# EAGLE design OBS-buttons-processor (EAGLE 7.7.0)
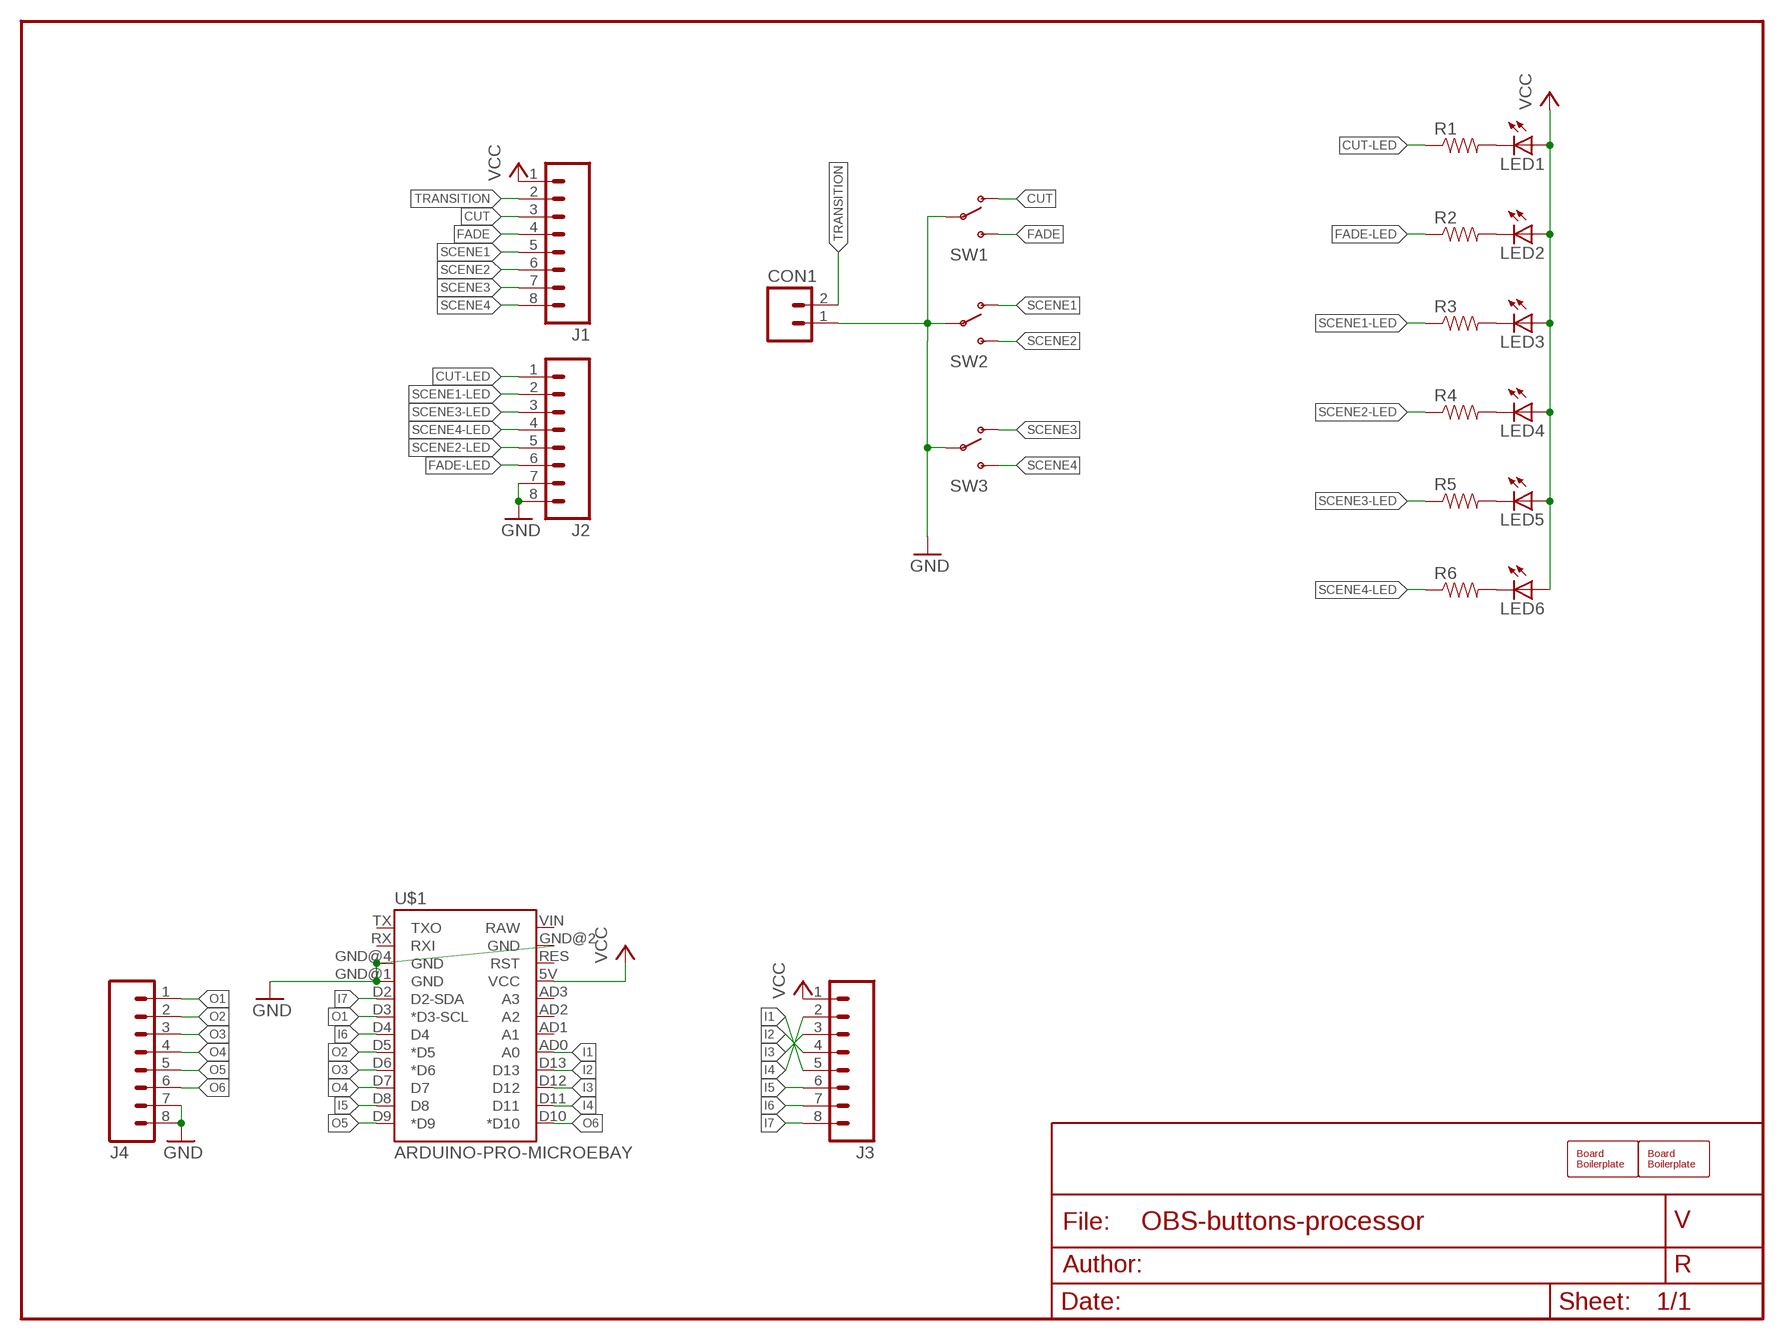
[diagram p0: schematic, sheet 1]

## Parts
BOARD1  BOARD100X50-NOHOLES  [BOARD-SEEED10X5-NOHOLES]
BOARD2  BOARD100X50-NOHOLES  [BOARD-SEEED10X5-NOHOLES]
CON1  CONNECTOR-M02508-LOCK  [MSTB2]
J1  CONNECTOR-M08LOCK  [1X08_LOCK]
J2  CONNECTOR-M08LOCK  [1X08_LOCK]
J3  CONNECTOR-M08LOCK  [1X08_LOCK]
J4  CONNECTOR-M08LOCK  [1X08_LOCK]
LED1  LEDLED5MM  [LED5MM]
LED2  LEDLED5MM  [LED5MM]
LED3  LEDLED5MM  [LED5MM]
LED4  LEDLED5MM  [LED5MM]
LED5  LEDLED5MM  [LED5MM]
LED6  LEDLED5MM  [LED5MM]
R1  RPTH04  [AXIAL-0.4-RES]
R2  RPTH04  [AXIAL-0.4-RES]
R3  RPTH04  [AXIAL-0.4-RES]
R4  RPTH04  [AXIAL-0.4-RES]
R5  RPTH04  [AXIAL-0.4-RES]
R6  RPTH04  [AXIAL-0.4-RES]
SW1  SWITCH-SPSTPTH-508  [SWITCH-SPDT-508]
SW2  SWITCH-SPSTPTH-508  [SWITCH-SPDT-508]
SW3  SWITCH-SPSTPTH-508  [SWITCH-SPDT-508]
U$1  ARDUINO-PRO-MICROEBAY  [ARDUINO-PRO-MICRO]

## Nets
CUT: J1.3 SW1.1(O)
CUT-LED: J2.1 R1.P$1
FADE: J1.4 SW1.3(S)
FADE-LED: J2.6 R2.P$1
GND: CON1.1(A) J2.7 J2.8 J4.7 J4.8 SW1.2(P) SW2.2(P) SW3.2(P) U$1.GND@1(GND) U$1.GND@2(GND) U$1.GND@4(GND)
I1: J3.5 U$1.AD0(A0)
I2: J3.4 U$1.D13
I3: J3.3 U$1.D12
I4: J3.2 U$1.D11
I5: J3.6 U$1.D8
I6: J3.7 U$1.D4
I7: J3.8 U$1.D2(D2-SDA)
N$1: LED1.K(C) R1.P$2
N$2: LED2.K(C) R2.P$2
N$3: LED3.K(C) R3.P$2
N$4: LED4.K(C) R4.P$2
N$5: LED5.K(C) R5.P$2
N$6: LED6.K(C) R6.P$2
O1: J4.1 U$1.D3(*D3-SCL)
O2: J4.2 U$1.D5(*D5)
O3: J4.3 U$1.D6(*D6)
O4: J4.4 U$1.D7
O5: J4.5 U$1.D9(*D9)
O6: J4.6 U$1.D10(*D10)
SCENE1: J1.5 SW2.1(O)
SCENE1-LED: J2.2 R3.P$1
SCENE2: J1.6 SW2.3(S)
SCENE2-LED: J2.5 R4.P$1
SCENE3: J1.7 SW3.1(O)
SCENE3-LED: J2.3 R5.P$1
SCENE4: J1.8 SW3.3(S)
SCENE4-LED: J2.4 R6.P$1
TRANSITION: CON1.2(B) J1.2
VCC: J1.1 J3.1 LED1.A LED2.A LED3.A LED4.A LED5.A LED6.A U$1.5V(VCC)
Unconnected: U$1.AD1(A1) U$1.AD2(A2) U$1.AD3(A3) U$1.RES(RST) U$1.RX(RXI) U$1.TX(TXO) U$1.VIN(RAW)

## Library data of the parts
BOARD1 BOARD2 = SPCoast:BOARD
CON1 = SPCoast:CONNECTOR-M02: PHOENIX CONNECTOR
J1-J4 = SPCoast:CONNECTOR-M08: Header 8 Standard 8-pin 0.1" header. Use with straight break away headers (SKU : PRT-00116), right angle break away headers (PRT-00553), swiss pins (PRT-00743), machine pins (PRT-00117), and female headers (PRT-00115).
LED1-LED6 = SPCoast:LED*
R1-R6 = SPCoast:R*: Resistor Basic schematic elements and footprints for 0603, 1206, and PTH 1/10th watt (small) resistors.
SW1-SW3 = SPCoast:SWITCH-SPST: SPST Switch Simple slide switch. Spark Fun Electronics SKU : COM-00102
U$1 = SPCoast:ARDUINO-PRO-MICRO

## Board
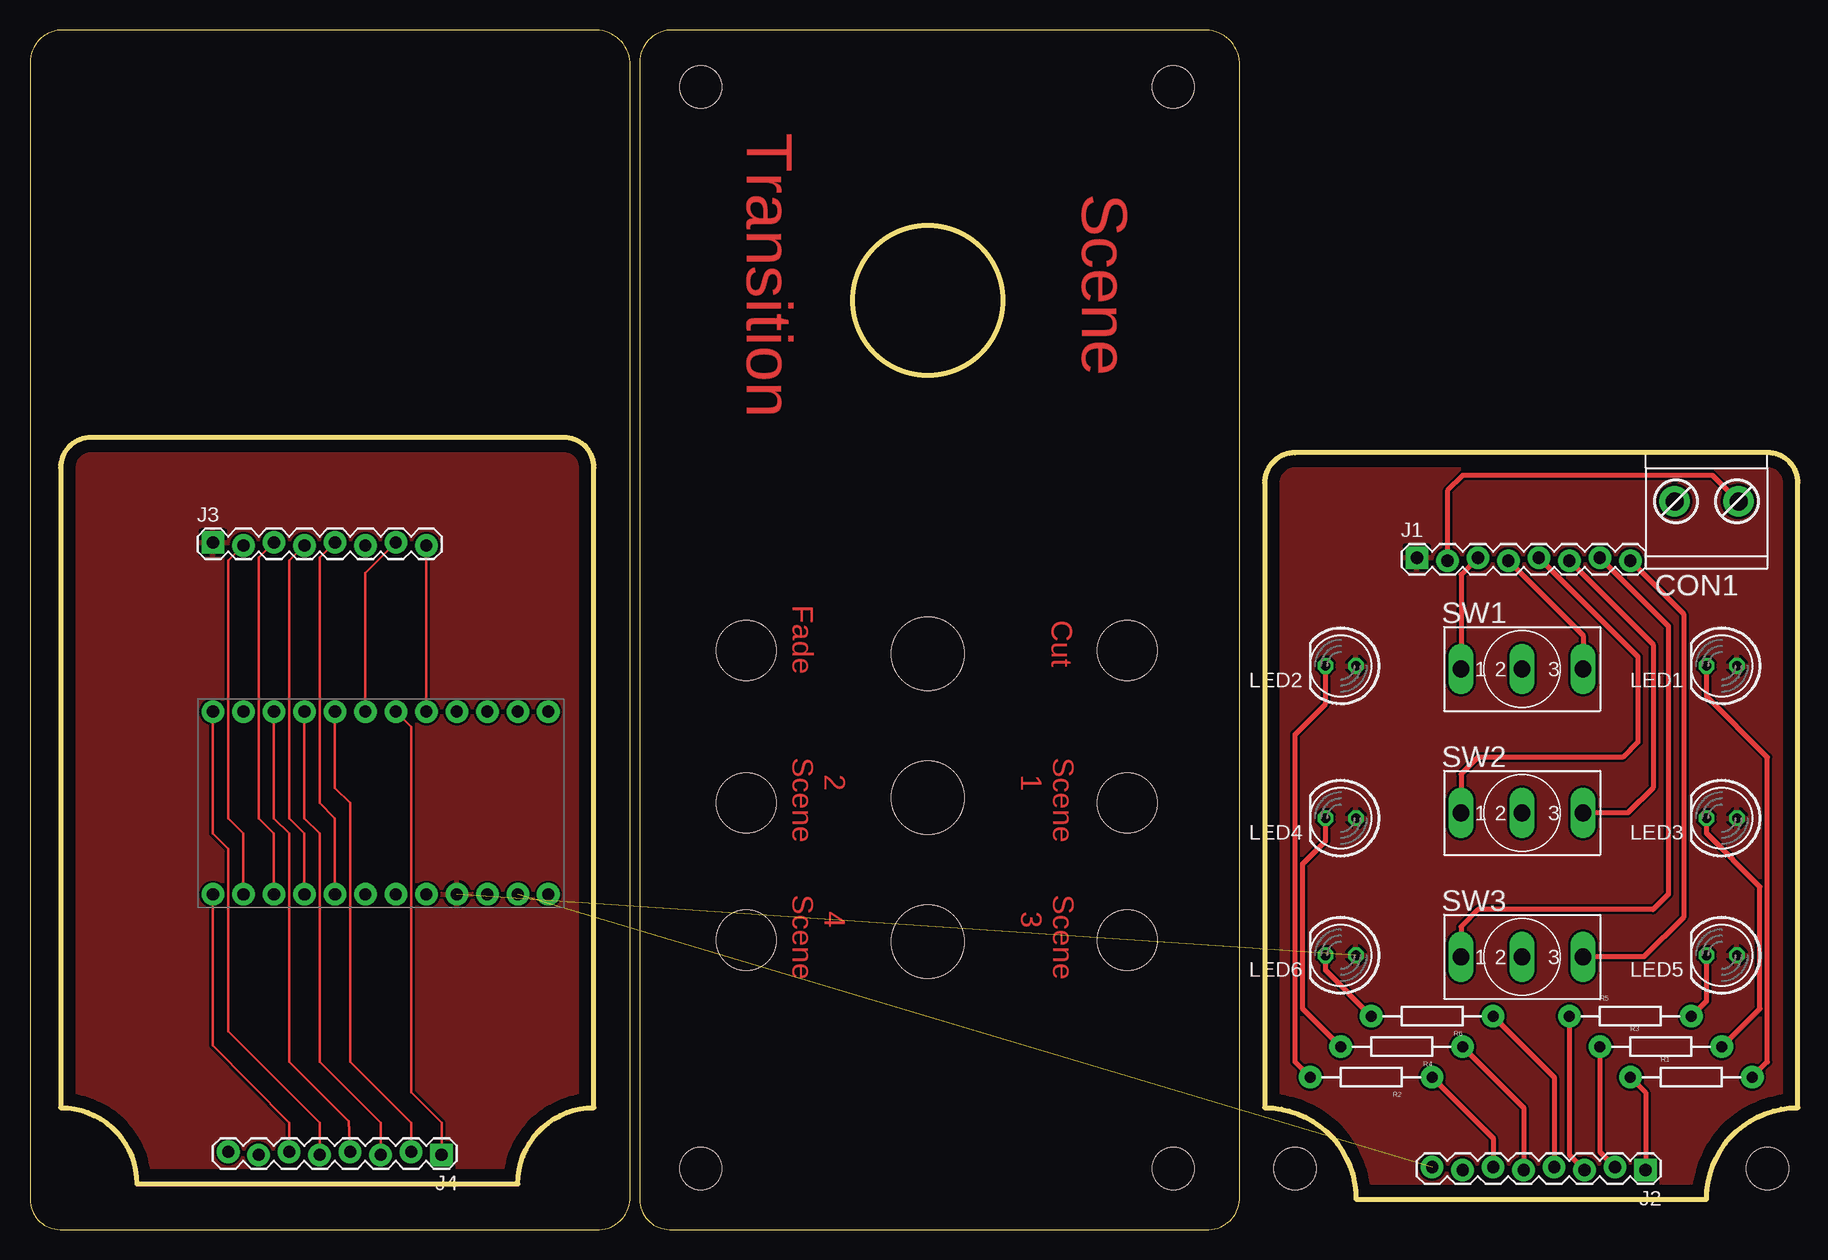
[diagram p1: board, top side]
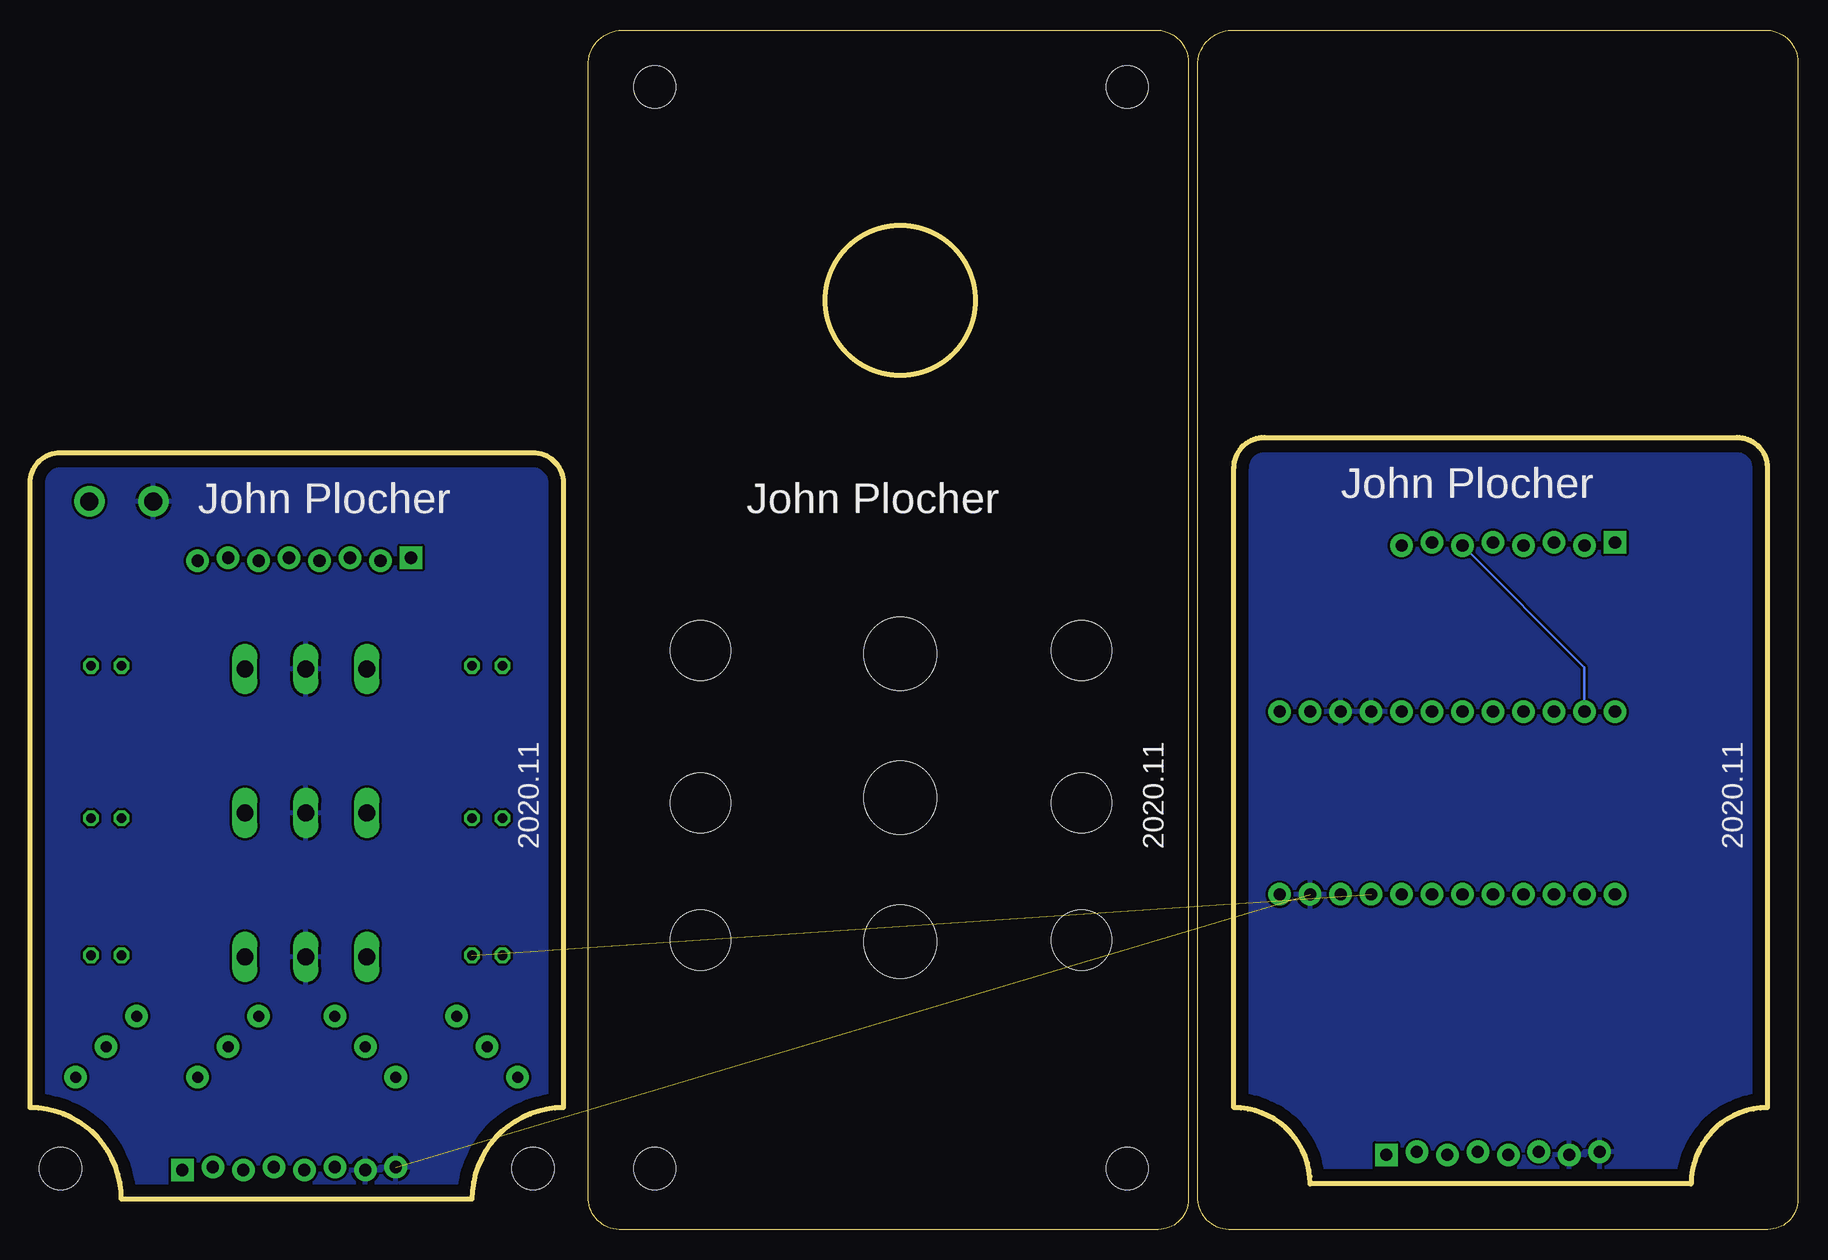
[diagram p2: board, bottom side, seen from below]

Size 144.78 x 81.17 mm. Coordinates in mm from the lower left corner, seen from the top.
Outline: 0,7.62 arc-90 6.35,1.27 38.1,1.27 arc-90 44.45,7.62 44.45,60.96 arc90 41.91,63.5 2.54,63.5 arc90 0,60.96 0,7.62
Outline: 100.33,7.62 arc-90 107.95,0 137.16,0 arc-90 144.78,7.62 144.78,59.69 arc90 142.24,62.23 102.87,62.23 arc90 100.33,59.69 100.33,7.62
Outline: circle at 72.26,74.92 radius 6.25
Copper layers (1*16): Top 0.035mm / dielectric 1.5mm / Bottom 0.035mm
Design rules "default": minimum track width 10mil, minimum drill 0.6mm, track to track 8mil, track to pad 8mil, pad to pad 8mil, via to via 8mil, smd to smd 8mil, copper to edge 40mil, drill to drill 8mil, minimum pad ring 10mil, minimum via ring 8mil, stop-mask expansion 4mil, vias tented up to drill 0mil, thermal gap 10mil
Holes 6.1 mm at 72.26,33.46 72.26,21.46 72.26,45.46
Holes 5 mm at 88.9,45.72 57.15,45.72 88.9,33.02 88.9,21.59 57.15,21.59 57.15,33.02
Holes 3.5 mm at 53.34,92.71 92.71,92.71 53.34,2.54 92.71,2.54 102.87,2.54 142.24,2.54

### Footprints (pad centres in the part's own frame; a part is rotated, then mirrored left to right if it is on the bottom)
MSTB2 = drill 1.5 pad 2.54: 1 -2.667,1.016; 2 2.667,1.016
1X08_LOCK = drill 1.016 pad 1.88 square: 1 0,0.127 | drill 1.016 pad 1.88: 2 2.54,-0.127; 3 5.08,0.127; 4 7.62,-0.127; 5 10.16,0.127; 6 12.7,-0.127; 7 15.24,0.127; 8 17.78,-0.127
LED5MM = drill 0.813 octagon: A 1.27,0; K -1.27,0
AXIAL-0.4-RES = drill 0.9 pad 1.88: P$1 -5.08,0; P$2 5.08,0
SWITCH-SPDT-508 = drill 1.397 long: 1 -5.08,0; 2 0,0; 3 5.08,0
ARDUINO-PRO-MICRO = drill 1.016 pad 1.88: 5V 7.62,5.08; AD0 7.62,-5.08; AD1 7.62,-2.54; AD2 7.62,0; AD3 7.62,2.54; D2 -7.62,2.54; D3 -7.62,0; D4 -7.62,-2.54; D5 -7.62,-5.08; D6 -7.62,-7.62; D7 -7.62,-10.16; D8 -7.62,-12.7; D9 -7.62,-15.24; D10 7.62,-15.24; D11 7.62,-12.7; D12 7.62,-10.16; D13 7.62,-7.62; GND@1 7.62,10.16; GND@2 -7.62,7.62; GND@4 -7.62,5.08; RES 7.62,7.62; RX -7.62,10.16; TX -7.62,12.7; VIN 7.62,12.7

### Placement (x,y rotation side)
BOARD1  48.26,-2.54 0 top
BOARD2  -2.54,-2.54 0 top
CON1  137.16,57.15 0 top
J1  113.03,53.34 0 top
J2  132.08,2.54 180 top
J3  12.7,54.61 0 top
J4  31.75,3.81 180 top
LED1  138.43,44.45 0 top
LED2  106.68,44.45 0 top
LED3  138.43,31.75 0 top
LED4  106.68,31.75 0 top
LED5  138.43,20.32 0 top
LED6  106.68,20.32 0 top
R1  135.89,10.16 0 top
R2  109.22,10.16 180 top
R3  133.35,12.7 0 top
R4  111.76,12.7 180 top
R5  130.81,15.24 0 top
R6  114.3,15.24 180 top
SW1  121.79,44.19 0 top
SW2  121.79,32.19 0 top
SW3  121.79,20.19 0 top
U$1  27.94,33.02 270 top

### Tracks (layer width: path | path; a pad name or v marks a point on that pad's centre or on a via)
CUT
  Top 0.406: J1.3 116.71,52.07 SW1.1
CUT-LED
  Top 0.406: R1.P$1 132.08,8.89 J2.1
FADE
  Top 0.406: J1.4 126.87,46.99 SW1.3
FADE-LED
  Top 0.406: R2.P$1 119.38,5.08 J2.6 119.25,2.67
GND  (1 unrouted)
  pour Bottom: 100.33,59.69 100.33,2.54 arc90 102.87,0 142.24,0 arc90 144.78,2.54 144.78,59.69 arc90 142.24,62.23 102.87,62.23 arc90
  pour Bottom: 0,60.96 0,3.81 arc90 2.54,1.27 41.91,1.27 arc90 44.45,3.81 44.45,60.96 arc90 41.91,63.5 2.54,63.5 arc90
I1
  Top 0.203: J3.5 21.59,53.47 21.59,33.02 22.86,31.75 U$1.AD0
I2
  Top 0.203: J3.4 19.05,53.21 19.05,31.75 20.32,30.48 U$1.D13
I3
  Top 0.203: J3.3 16.51,53.47 16.51,31.75 17.78,30.48 U$1.D12
I4
  Top 0.203: J3.2 13.97,53.21 13.97,31.75 15.24,30.48 U$1.D11
I5
  Bottom 0.203: J3.6 15.24,44.32 U$1.D8
I6
  Top 0.203: J3.7 25.4,52.2 U$1.D4
I7
  Top 0.203: J3.8 U$1.D2
N$1
  Top 0.406: R1.P$2 142.24,11.43 142.24,36.83 137.16,41.91 LED1.K
N$2
  Top 0.406: R2.P$2 102.87,11.43 102.87,38.73 105.41,41.27 LED2.K
N$3
  Top 0.406: R3.P$2 141.61,15.88 141.61,26.04 137.16,30.48 LED3.K
N$4
  Top 0.406: R4.P$2 103.5,15.88 103.5,27.94 105.41,29.84 LED4.K
N$5
  Top 0.406: R5.P$2 137.16,16.51 LED5.K
N$6
  Top 0.406: R6.P$2 105.41,19.05 LED6.K
O1
  Top 0.203: U$1.D3 29.21,39.37 29.21,8.89 31.75,6.35 J4.1
O2
  Top 0.203: U$1.D5 22.86,34.29 24.13,33.02 24.13,11.43 29.21,6.35 J4.2
O3
  Top 0.203: U$1.D6 20.32,31.75 21.59,30.48 21.59,11.43 26.67,6.35 J4.3
O4
  Top 0.203: U$1.D7 17.78,31.75 19.05,30.48 19.05,11.43 24,6.48 J4.4
O5
  Top 0.203: U$1.D9 12.7,30.48 13.97,29.21 13.97,13.97 21.59,6.35 J4.5
O6
  Top 0.203: J4.6 19.05,6.35 12.7,12.83 U$1.D10
SCENE1
  Top 0.406: J1.5 131.45,45.21 131.45,38.1 130.18,36.83 118.11,36.83 116.71,35.43 SW2.1
SCENE1-LED
  Top 0.406: R3.P$1 128.27,3.94 J2.2
SCENE2
  Top 0.406: J1.6 132.72,46.23 132.72,34.29 130.62,32.19 SW2.3
SCENE2-LED
  Top 0.406: R4.P$1 121.92,7.62 J2.5
SCENE3
  Top 0.406: J1.7 133.99,47.75 133.99,25.4 132.72,24.13 118.11,24.13 116.71,22.73 SW3.1
SCENE3-LED
  Top 0.406: R5.P$1 125.73,3.68 J2.3
SCENE4
  Top 0.406: J1.8 135.25,48.77 135.25,23.5 131.95,20.19 SW3.3
SCENE4-LED
  Top 0.406: R6.P$1 124.46,10.16 J2.4
TRANSITION
  Top 0.406: CON1.2 137.67,60.33 116.84,60.33 115.57,59.05 J1.2
VCC  (1 unrouted)
  pour Top: 100.33,59.69 100.33,2.54 arc90 102.87,0 142.24,0 arc90 144.78,2.54 144.78,59.69 arc90 142.24,62.23 102.87,62.23 arc90
  pour Top: 0,60.96 0,3.81 arc90 2.54,1.27 41.91,1.27 arc90 44.45,3.81 44.45,60.96 arc90 41.91,63.5 2.54,63.5 arc90

### Text on the board
Top: Transition | Scene | Fade | Cut | 2 / Scene | Scene / 1 | 4 / Scene | Scene / 3
bPlace: John Plocher | John Plocher | John Plocher | 2020.11 | 2020.11 | 2020.11